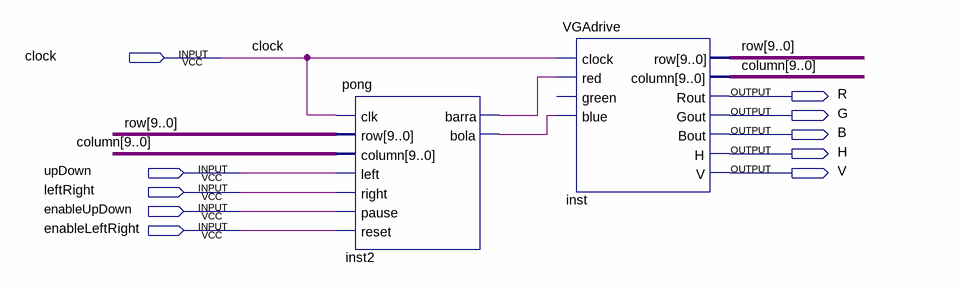
[diagram p0: schematic sheet]
// Quartus schematic vgatest.bdf as structural Verilog: 2 symbols, 10 pins
module vgatest (
  input  clock,
  input  upDown,
  input  leftRight,
  input  enableUpDown,
  input  enableLeftRight,
  output R,
  output G,
  output B,
  output H,
  output V
);

  wire inst2_barra, inst2_bola;
  wire [9:0] column, row;

  pong inst2 (
    .clk(clock), .row(row), .column(column), .left(upDown), .right(leftRight), .pause(enableUpDown),
    .reset(enableLeftRight), .barra(inst2_barra), .bola(inst2_bola));
  VGAdrive inst (
    .clock(clock), .red(inst2_barra), .blue(inst2_bola), .row(row), .column(column), .Rout(R), .Gout(G),
    .Bout(B), .H(H), .V(V));  // open: green
endmodule
